# Altium schematic sheet solenoid.SchDoc: Solenoids
size A4; Organization: Badgerloop Electrical; Address1: 133 Engineering Research Building; Address2: 1500 Engineering Drive; Address3: Madison, Wi 53706
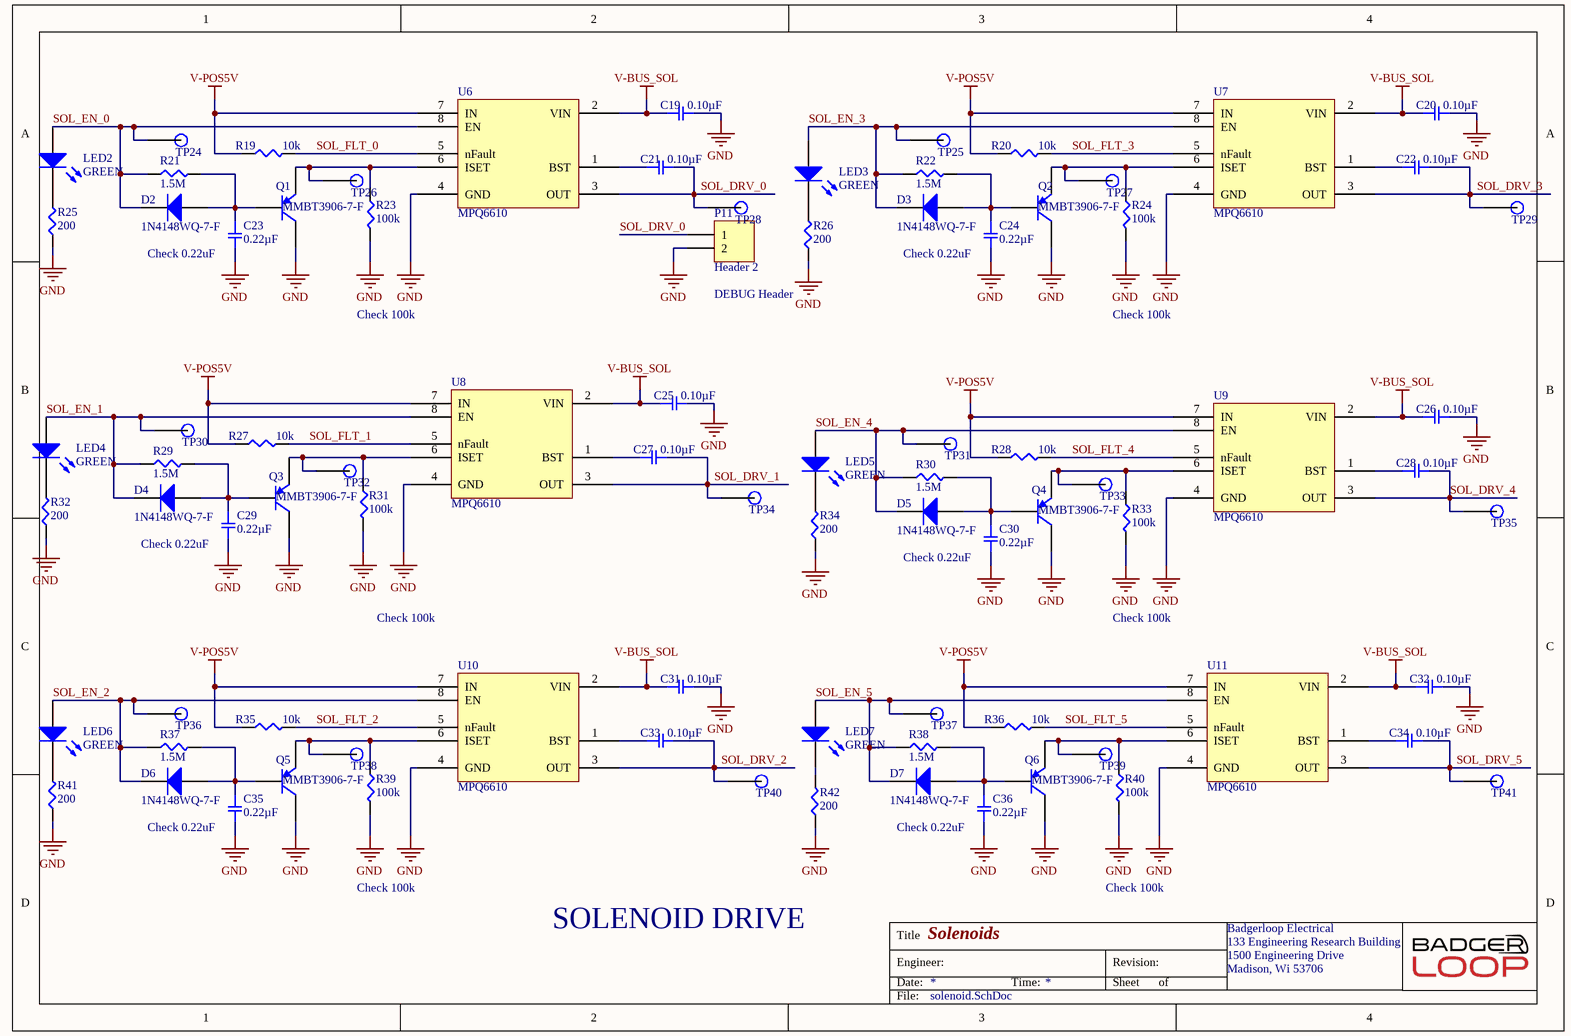
[diagram p0: solenoid.SchDoc]

## Parts
C19  0.10µF  [SMD-0805C]
C20  0.10µF  [SMD-0805C]
C21  0.10µF  [SMD-0805C]
C22  0.10µF  [SMD-0805C]
C23  0.22µF  [SMD-0805C]
C24  0.22µF  [SMD-0805C]
C25  0.10µF  [SMD-0805C]
C26  0.10µF  [SMD-0805C]
C27  0.10µF  [SMD-0805C]
C28  0.10µF  [SMD-0805C]
C29  0.22µF  [SMD-0805C]
C30  0.22µF  [SMD-0805C]
C31  0.10µF  [SMD-0805C]
C32  0.10µF  [SMD-0805C]
C33  0.10µF  [SMD-0805C]
C34  0.10µF  [SMD-0805C]
C35  0.22µF  [SMD-0805C]
C36  0.22µF  [SMD-0805C]
D2  1N4148WQ-7-F  [INDM3838X18N]
D3  1N4148WQ-7-F  [INDM3838X18N]
D4  1N4148WQ-7-F  [INDM3838X18N]
D5  1N4148WQ-7-F  [INDM3838X18N]
D6  1N4148WQ-7-F  [INDM3838X18N]
D7  1N4148WQ-7-F  [INDM3838X18N]
LED2  GREEN  [LED 0603 GREEN]
LED3  GREEN  [LED 0603 GREEN]
LED4  GREEN  [LED 0603 GREEN]
LED5  GREEN  [LED 0603 GREEN]
LED6  GREEN  [LED 0603 GREEN]
LED7  GREEN  [LED 0603 GREEN]
P11  Header 2  [Pin Header 1x2 TH Pitch 2.54mm]
Q1  MMBT3906-7-F  [SOTFL103P240X110-3N]
Q2  MMBT3906-7-F  [SOTFL103P240X110-3N]
Q3  MMBT3906-7-F  [SOTFL103P240X110-3N]
Q4  MMBT3906-7-F  [SOTFL103P240X110-3N]
Q5  MMBT3906-7-F  [SOTFL103P240X110-3N]
Q6  MMBT3906-7-F  [SOTFL103P240X110-3N]
R19  10k  [SMD-0805-RES]
R20  10k  [SMD-0805-RES]
R21  1.5M  [SMD-0805-RES]
R22  1.5M  [SMD-0805-RES]
R23  100k  [SMD-0805-RES]
R24  100k  [SMD-0805-RES]
R25  200  [SMD-0805-RES]
R26  200  [SMD-0805-RES]
R27  10k  [SMD-0805-RES]
R28  10k  [SMD-0805-RES]
R29  1.5M  [SMD-0805-RES]
R30  1.5M  [SMD-0805-RES]
R31  100k  [SMD-0805-RES]
R32  200  [SMD-0805-RES]
R33  100k  [SMD-0805-RES]
R34  200  [SMD-0805-RES]
R35  10k  [SMD-0805-RES]
R36  10k  [SMD-0805-RES]
R37  1.5M  [SMD-0805-RES]
R38  1.5M  [SMD-0805-RES]
R39  100k  [SMD-0805-RES]
R40  100k  [SMD-0805-RES]
R41  200  [SMD-0805-RES]
R42  200  [SMD-0805-RES]
TP24  TP  [Test Point]  (value not drawn)
TP25  TP  [Test Point]  (value not drawn)
TP26  TP  [Test Point]  (value not drawn)
TP27  TP  [Test Point]  (value not drawn)
TP28  TP  [Test Point]  (value not drawn)
TP29  TP  [Test Point]  (value not drawn)
TP30  TP  [Test Point]  (value not drawn)
TP31  TP  [Test Point]  (value not drawn)
TP32  TP  [Test Point]  (value not drawn)
TP33  TP  [Test Point]  (value not drawn)
TP34  TP  [Test Point]  (value not drawn)
TP35  TP  [Test Point]  (value not drawn)
TP36  TP  [Test Point]  (value not drawn)
TP37  TP  [Test Point]  (value not drawn)
TP38  TP  [Test Point]  (value not drawn)
TP39  TP  [Test Point]  (value not drawn)
TP40  TP  [Test Point]  (value not drawn)
TP41  TP  [Test Point]  (value not drawn)
U6  MPQ6610  [SOP127P600X175-8N]
U7  MPQ6610  [SOP127P600X175-8N]
U8  MPQ6610  [SOP127P600X175-8N]
U9  MPQ6610  [SOP127P600X175-8N]
U10  MPQ6610  [SOP127P600X175-8N]
U11  MPQ6610  [SOP127P600X175-8N]

## Nets
GND: C19.2 C20.2 C23.2 C24.2 C25.2 C26.2 C29.2 C30.2 C31.2 C32.2 C35.2 C36.2 P11.2 Q1.3(C) Q2.3(C) Q3.3(C) Q4.3(C) Q5.3(C) Q6.3(C) R23.2 R24.2 R25.1 R26.1 R31.2 R32.1 R33.2 R34.1 R39.2 R40.2 R41.1 R42.1 U6.4(GND) U7.4(GND) U8.4(GND) U9.4(GND) U10.4(GND) U11.4(GND)
V-BUS_SOL: C19.1 C20.1 C25.1 C26.1 C31.1 C32.1 U6.2(VIN) U7.2(VIN) U8.2(VIN) U9.2(VIN) U10.2(VIN) U11.2(VIN)
V-POS5V: R19.1 R20.1 R27.1 R28.1 R35.1 R36.1 U6.7(IN) U7.7(IN) U8.7(IN) U9.7(IN) U10.7(IN) U11.7(IN)
SOL_DRV_0: C21.2 P11.1 TP28.1 U6.3(OUT)
SOL_DRV_1: C27.2 TP34.1 U8.3(OUT)
SOL_DRV_2: C33.2 TP40.1 U10.3(OUT)
SOL_DRV_3: C22.2 TP29.1 U7.3(OUT)
SOL_DRV_4: C28.2 TP35.1 U9.3(OUT)
SOL_DRV_5: C34.2 TP41.1 U11.3(OUT)
SOL_EN_0: D2.2(K) LED2.1(A) R21.1 TP24.1 U6.8(EN)
SOL_EN_1: D4.2(K) LED4.1(A) R29.1 TP30.1 U8.8(EN)
SOL_EN_2: D6.2(K) LED6.1(A) R37.1 TP36.1 U10.8(EN)
SOL_EN_3: D3.2(K) LED3.1(A) R22.1 TP25.1 U7.8(EN)
SOL_EN_4: D5.2(K) LED5.1(A) R30.1 TP31.1 U9.8(EN)
SOL_EN_5: D7.2(K) LED7.1(A) R38.1 TP37.1 U11.8(EN)
SOL_FLT_0: R19.2 U6.5(nFault)
SOL_FLT_1: R27.2 U8.5(nFault)
SOL_FLT_2: R35.2 U10.5(nFault)
SOL_FLT_3: R20.2 U7.5(nFault)
SOL_FLT_4: R28.2 U9.5(nFault)
SOL_FLT_5: R36.2 U11.5(nFault)
NetC21_1: C21.1 U6.1(BST)
NetC22_1: C22.1 U7.1(BST)
NetC23_1: C23.1 D2.1(A) Q1.1(B) R21.2
NetC24_1: C24.1 D3.1(A) Q2.1(B) R22.2
NetC27_1: C27.1 U8.1(BST)
NetC28_1: C28.1 U9.1(BST)
NetC29_1: C29.1 D4.1(A) Q3.1(B) R29.2
NetC30_1: C30.1 D5.1(A) Q4.1(B) R30.2
NetC33_1: C33.1 U10.1(BST)
NetC34_1: C34.1 U11.1(BST)
NetC35_1: C35.1 D6.1(A) Q5.1(B) R37.2
NetC36_1: C36.1 D7.1(A) Q6.1(B) R38.2
NetLED2_2: LED2.2(K) R25.2
NetLED3_2: LED3.2(K) R26.2
NetLED4_2: LED4.2(K) R32.2
NetLED5_2: LED5.2(K) R34.2
NetLED6_2: LED6.2(K) R41.2
NetLED7_2: LED7.2(K) R42.2
NetQ1_2: Q1.2(E) R23.1 TP26.1 U6.6(ISET)
NetQ2_2: Q2.2(E) R24.1 TP27.1 U7.6(ISET)
NetQ3_2: Q3.2(E) R31.1 TP32.1 U8.6(ISET)
NetQ4_2: Q4.2(E) R33.1 TP33.1 U9.6(ISET)
NetQ5_2: Q5.2(E) R39.1 TP38.1 U10.6(ISET)
NetQ6_2: Q6.2(E) R40.1 TP39.1 U11.6(ISET)

## Notes on the sheet
- (near C23) Check 0.22uF
- DEBUG Header
- (near C24) Check 0.22uF
- Check 100k
- (near C29) Check 0.22uF
- (near C30) Check 0.22uF
- (near C35) Check 0.22uF
- (near C36) Check 0.22uF
- SOLENOID DRIVE
- Title
- Engineer:
- Date:
- Time:
- Revision:
- Sheet
- of
- File:

## Library data of the parts
C19-C22 C25-C28 C31-C34 = GRM21B7U1A104JA01L: CAP CER 0.1UF 10V U2J 0805; Manufacturer: Murata Electronics North America; Factory Stock: 0; Unit Price (USD): 0.4; Minimum Quantity: 1; Tolerance: ±5%; Datasheets: http://www.murata.com/~/media/webrenewal/support/library/catalog/products/capacitor/mlcc/c02e.pdf; Image: //media.digikey.com/Renders/Murata%20Renders/0805%20(2012%20Metric)%20.85mm.jpg; Digi-Key Part Number: 490-11592-1-ND; Part Number: GRM21B7U1A104JA01L; Quantity Available: 3390; @ qty: 0; Packaging: Cut Tape (CT); Series: GRM; Part Status: Active; Value: 0.10µF; Voltage: 10V; Temperature Coefficient: U2J; Operating Temperature: -55°C ~ 125°C; Features: -; Ratings: -; Applications: General Purpose; Mounting Type: Surface Mount, MLCC; Package / Case: 0805 (2012 Metric); Size / Dimension: 0.079" L x 0.049" W (2.00mm x 1.25mm); Height - Seated (Max): -; Thickness (Max): 0.053" (1.35mm); Lead Spacing: -; Lead Style: -
C23 C24 C29 C30 C35 C36 = LLA215R71A224MA14L: CAP CER 0.22UF 10V X7R 0805; Manufacturer: Murata Electronics North America; Factory Stock: 0; Unit Price (USD): 0.36; Minimum Quantity: 1; Tolerance: ±20%; Datasheets: http://www.murata.com/~/media/webrenewal/support/library/catalog/products/capacitor/mlcc/c02e.pdf; Image: //media.digikey.com/Renders/Murata%20Renders/0805-LLA.jpg; Digi-Key Part Number: 490-4432-1-ND; Part Number: LLA215R71A224MA14L; Quantity Available: 9914; @ qty: 0; Packaging: Cut Tape (CT); Series: LLA; Part Status: Active; Value: 0.22µF; Voltage: 10V; Temperature Coefficient: X7R; Operating Temperature: -55°C ~ 125°C; Features: Low ESL (Multi-Terminal); Ratings: -; Applications: Bypass, Decoupling; Mounting Type: Surface Mount, MLCC; Package / Case: 0805 (2012 Metric); Size / Dimension: 0.079" L x 0.049" W (2.00mm x 1.25mm); Height - Seated (Max): -; Thickness (Max): 0.022" (0.55mm); Lead Spacing: -; Lead Style: -
D2-D7 = 1N4148WQ-7-F: Diodes - General Purpose, Power, Switching SMT Fast Switching Diode; Manufacturer: Diodes Inc.; Digikey Link: https://www.digikey.com/product-detail/en/diodes-incorporated/1N4148WQ-7-F/1N4148WQ-7-FDITR-ND/8136126; Manufacturer P/N: 1N4148WQ-7-F; Digikey P/N: 1N4148WQ-7-FDITR-ND
LED2-LED7 = LED GREEN 0603: Manufacturer: Lite-On Inc.; Manufacturer P/N: LTST-C190KGKT; Digikey P/N: 160-1435-1-ND; Package / Case: 0603; Color: GREEN
P11 = Header 2: Header, 2-Pin; LatestRevisionDate: 17-Jul-2002; LatestRevisionNote: Re-released for DXP Platform.; Publisher: Altium Limited
Q1-Q6 = MMBT3906-7-F: Manufacturer: Diodes Zetex; Collector Emitter Voltage (VCEO): 40V; Max Power Dissipation: 300mW; Polarity: PNP; Max Collector Current: 200mA; hFE Min: 100; Number of Elements: 1; Frequency: 250MHz; Emitter Base Voltage (VEBO): 6V; Collector Emitter Saturation Voltage: -400mV; Element Configuration: Single; Continuous Collector Current: -200mA; Voltage Rating (DC): -40V; Supplier 1: Digi-Key; Manufacturer Part Number: MMBT3906-7-F; Stock 1: 687580; Pricing 1: 1=0.12000, 10=0.11400, 100=0.06190, 500=0.03806, 1000=0.02596 (USD); RoHS: Yes; Mount: Surface Mount; Case/Package: SOT-23; Number of Pins: 3; Weight: 0.000282oz; Contact Plating: Tin,Matte; Min Operating Temperature: -55°C; Max Operating Temperature: 150°C; Packaging: Tape and Reel; Package Quantity: 3000; Transition Frequency: 250MHz; Collector Emitter Breakdown Voltage: 40V; Max Breakdown Voltage: 40V; Collector Base Voltage (VCBO): 40V; Power Dissipation: 300mW; Max Frequency: 250MHz; Gain Bandwidth Product: 250MHz; Current Rating: -200mA; Length: 3.05mm; Height: 1mm; Width: 1.4mm; Radiation Hardening: No; REACH SVHC: No SVHC; Lead Free: Lead Free; ComponentLink1URL: https://datasheet.ciiva.com/27052/1540746-27052408.pdf?src-supplier=Jameco; ComponentLink1Description: https://datasheet.ciiva.com/27052/1540746-27052408.pdf?src-supplier=Jameco; ComponentLink2URL: https://datasheet.ciiva.com/15139/getdatasheetpartid-255292-15139821.pdf?src-supplier=Verical; ComponentLink2Description: https://datasheet.ciiva.com/15139/getdatasheetpartid-255292-15139821.pdf?src-supplier=Verical
R19 R20 R27 R28 R35 R36 = ERJ-P06J103V: RES SMD 10K OHM 5% 1/2W 0805; Manufacturer: Panasonic Electronic Components; Factory Stock: 0; Unit Price (USD): 0.01839; @ qty: 1500; Minimum Quantity: 1; Power (Watts): 0.5W, 1/2W; Temperature Coefficient: ±200ppm/°C; Part Number: ERJ-P06J103V; Datasheets: https://industrial.panasonic.com/cdbs/www-data/pdf/RDA0000/AOA0000C243.pdf; Image: //media.digikey.com/Renders/Panasonic%20Renders/ERJ-0805%20Pkg.jpg; Digi-Key Part Number: P10KADCT-ND; Quantity Available: 413576; Packaging: Cut Tape (CT); Series: ERJ; Part Status: Active; Value: 10k; Tolerance: ±5%; Composition: Thick Film; Features: Automotive AEC-Q200, Pulse Withstanding; Operating Temperature: -55°C ~ 155°C; Package / Case: 0805 (2012 Metric); Supplier Device Package: 0805; Size / Dimension: 0.079" L x 0.049" W (2.00mm x 1.25mm); Height - Seated (Max): 0.028" (0.70mm); Number of Terminations: 2; Failure Rate: -
R21 R22 R29 R30 R37 R38 = ERJ-6GEYJ155V: RES SMD 1.5M OHM 5% 1/8W 0805; Manufacturer: Panasonic Electronic Components; Factory Stock: 0; Unit Price (USD): 0.00496; @ qty: 1500; Minimum Quantity: 1; Power (Watts): 0.125W, 1/8W; Temperature Coefficient: -400/ +150ppm/°C; Part Number: ERJ-6GEYJ155V; Datasheets: http://industrial.panasonic.com/www-cgi/jvcr13pz.cgi?E+PZ+3+AOA0001+ERJ6GEYJ155V+7+WW; Image: //media.digikey.com/Renders/Panasonic%20Renders/ERJ-0805%20Pkg.jpg; Digi-Key Part Number: P1.5MACT-ND; Quantity Available: 51728; Packaging: Cut Tape (CT); Series: ERJ; Part Status: Active; Value: 1.5M; Tolerance: ±5%; Composition: Thick Film; Features: Automotive AEC-Q200; Operating Temperature: -55°C ~ 155°C; Package / Case: 0805 (2012 Metric); Supplier Device Package: 0805; Size / Dimension: 0.079" L x 0.049" W (2.00mm x 1.25mm); Height - Seated (Max): 0.028" (0.70mm); Number of Terminations: 2; Failure Rate: -
R23 R24 R31 R33 R39 R40 = ERJ-P06J104V: RES SMD 100K OHM 5% 1/2W 0805; Manufacturer: Panasonic Electronic Components; Factory Stock: 0; Unit Price (USD): 0.01839; @ qty: 1500; Minimum Quantity: 1; Power (Watts): 0.5W, 1/2W; Temperature Coefficient: ±200ppm/°C; Part Number: ERJ-P06J104V; Datasheets: https://industrial.panasonic.com/cdbs/www-data/pdf/RDA0000/AOA0000C243.pdf; Image: //media.digikey.com/Renders/Panasonic%20Renders/ERJ-0805%20Pkg.jpg; Digi-Key Part Number: P100KADCT-ND; Quantity Available: 82264; Packaging: Cut Tape (CT); Series: ERJ; Part Status: Active; Value: 100k; Tolerance: ±5%; Composition: Thick Film; Features: Automotive AEC-Q200, Pulse Withstanding; Operating Temperature: -55°C ~ 155°C; Package / Case: 0805 (2012 Metric); Supplier Device Package: 0805; Size / Dimension: 0.079" L x 0.049" W (2.00mm x 1.25mm); Height - Seated (Max): 0.028" (0.70mm); Number of Terminations: 2; Failure Rate: -
R25 R26 R32 R34 R41 R42 = ERJ-P06F2000V: RES SMD 200 OHM 1% 1/2W 0805; Manufacturer: Panasonic Electronic Components; Factory Stock: 0; Unit Price (USD): 0.02534; @ qty: 1500; Minimum Quantity: 1; Power (Watts): 0.5W, 1/2W; Temperature Coefficient: ±100ppm/°C; Part Number: ERJ-P06F2000V; Datasheets: https://industrial.panasonic.com/cdbs/www-data/pdf/RDA0000/AOA0000C243.pdf; Image: //media.digikey.com/Renders/Panasonic%20Renders/ERJ-0805%20Pkg.jpg; Digi-Key Part Number: P16064CT-ND; Quantity Available: 14258; Packaging: Cut Tape (CT); Series: ERJ; Part Status: Active; Value: 200; Tolerance: ±1%; Composition: Thick Film; Features: Automotive AEC-Q200, Pulse Withstanding; Operating Temperature: -55°C ~ 155°C; Package / Case: 0805 (2012 Metric); Supplier Device Package: 0805; Size / Dimension: 0.079" L x 0.049" W (2.00mm x 1.25mm); Height - Seated (Max): 0.028" (0.70mm); Number of Terminations: 2; Failure Rate: -
TP24-TP41 = TP: SMD TEST POINT